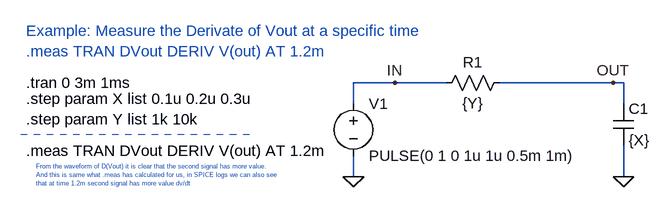
[diagram p0: schematic 04-Meas_Derivative.asc]
04-Meas_Derivative.asc, the LTspice schematic file:
Version 4
SHEET 1 880 680
WIRE 0 160 -64 160
WIRE 80 160 0 160
WIRE 336 160 160 160
WIRE 352 160 336 160
WIRE -64 192 -64 160
WIRE 352 192 352 160
WIRE -64 304 -64 272
WIRE 352 304 352 256
FLAG -64 304 0
FLAG 352 304 0
FLAG 0 160 IN
FLAG 336 160 OUT
SYMBOL voltage -64 176 R0
WINDOW 123 0 0 Left 2
WINDOW 39 0 0 Left 2
SYMATTR InstName V1
SYMATTR Value PULSE(0 1 0 1u 1u 0.5m 1m)
SYMBOL res 176 144 R90
WINDOW 0 0 56 VBottom 2
WINDOW 3 32 56 VTop 2
SYMATTR InstName R1
SYMATTR Value {Y}
SYMBOL cap 336 192 R0
SYMATTR InstName C1
SYMATTR Value {X}
TEXT -568 160 Left 2 !.tran 0 3m 1ms
TEXT -568 184 Left 2 !.step param X list 0.1u 0.2u 0.3u
TEXT -568 216 Left 2 !.step param Y list 1k 10k
TEXT -568 264 Left 2 !.meas TRAN DVout DERIV V(out) AT 1.2m
TEXT -568 80 Left 2 ;Example: Measure the Derivate of Vout at a specific time\n.meas TRAN DVout DERIV V(out) AT 1.2m
TEXT -552 288 Left 0 ;From the waveform of D(Vout) it is clear that the second signal has more value.\nAnd this is same what .meas has calculated for us, in SPICE logs we can also see\nthat at time 1.2m second signal has more value dv/dt
LINE Normal -224 240 -576 240 2

The netlist it stands for:
* 04-Meas_Derivative.asc
V1 IN 0 PULSE(0 1 0 1u 1u 0.5m 1m)
R1 OUT IN {Y}
C1 OUT 0 {X}
.tran 0 3m 1ms
.step param X list 0.1u 0.2u 0.3u
.step param Y list 1k 10k
.meas TRAN DVout DERIV V(out) AT 1.2m
* Example: Measure the Derivate of Vout at a specific time
* .meas TRAN DVout DERIV V(out) AT 1.2m
* From the waveform of D(Vout) it is clear that the second signal has more value.
* And this is same what .meas has calculated for us, in SPICE logs we can also see
* that at time 1.2m second signal has more value dv/dt
.backanno
.end